# Altium schematic sheet ZYNQ_US_SOC_PS.SchDoc
size A4; DocumentNumber: 54; SheetNumber: 54; SheetTotal: 54
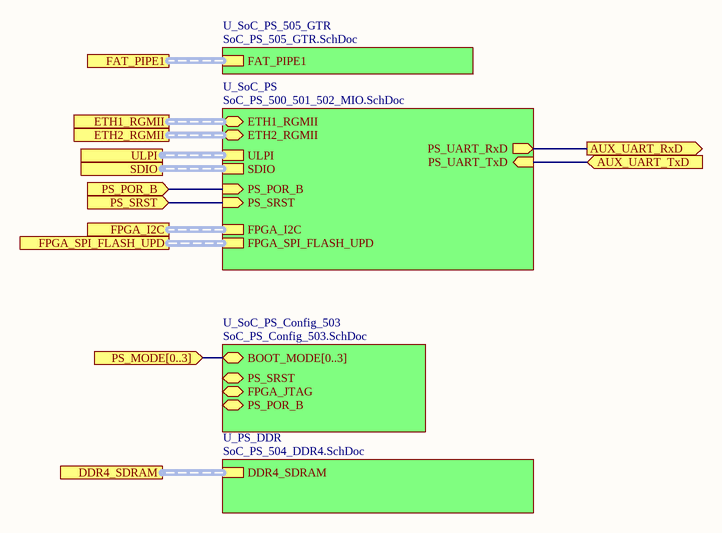
[diagram p0: ZYNQ_US_SOC_PS.SchDoc]

## Sub-sheets
U_PS_DDR = SoC_PS_504_DDR4.SchDoc: DDR4_SDRAM (harness DDR4)
U_SoC_PS = SoC_PS_500_501_502_MIO.SchDoc: ETH1_RGMII (bidir, harness RGMII), ETH2_RGMII (bidir, harness RGMII), PS_UART_RxD (out), PS_UART_TxD (in), ULPI (harness ULPI), SDIO (harness SDIO), PS_POR_B (in), FPGA_I2C (harness I2C), FPGA_SPI_FLASH_UPD (harness SPI_FLASH_UPD), PS_SRST (in)
U_SoC_PS_505_GTR = SoC_PS_505_GTR.SchDoc: FAT_PIPE1 (harness FAT_PIPE1)
U_SoC_PS_Config_503 = SoC_PS_Config_503.SchDoc: BOOT_MODE[0..3] (bidir), PS_SRST (bidir), FPGA_JTAG (bidir, harness JTAG4), PS_POR_B (bidir)

## Ports
AUX_UART_RxD (out), AUX_UART_TxD (in), DDR4_SDRAM (harness DDR4), ETH1_RGMII (harness RGMII), ETH2_RGMII (harness RGMII), FAT_PIPE1 (harness FAT_PIPE1), FPGA_I2C (harness I2C), FPGA_SPI_FLASH_UPD (harness SPI_FLASH_UPD), PS_MODE[0..3] (in), PS_POR_B (in), PS_SRST (in), SDIO (harness SDIO), ULPI (harness ULPI)

## Nets
AUX_UART_RxD: port AUX_UART_RxD, sheet U_SoC_PS/PS_UART_RxD
AUX_UART_TxD: port AUX_UART_TxD, sheet U_SoC_PS/PS_UART_TxD
PS_POR_B: port PS_POR_B, sheet U_SoC_PS/PS_POR_B
PS_SRST: port PS_SRST, sheet U_SoC_PS/PS_SRST

## Buses and harness runs
bus port PS_MODE[0..3] = sheet U_SoC_PS_Config_503/BOOT_MODE[0..3]
harness port DDR4_SDRAM = sheet U_PS_DDR/DDR4_SDRAM
harness port ETH1_RGMII = sheet U_SoC_PS/ETH1_RGMII
harness port ETH2_RGMII = sheet U_SoC_PS/ETH2_RGMII
harness port FAT_PIPE1 = sheet U_SoC_PS_505_GTR/FAT_PIPE1
harness port FPGA_I2C = sheet U_SoC_PS/FPGA_I2C
harness port FPGA_SPI_FLASH_UPD = sheet U_SoC_PS/FPGA_SPI_FLASH_UPD
harness port SDIO = sheet U_SoC_PS/SDIO
harness port ULPI = sheet U_SoC_PS/ULPI